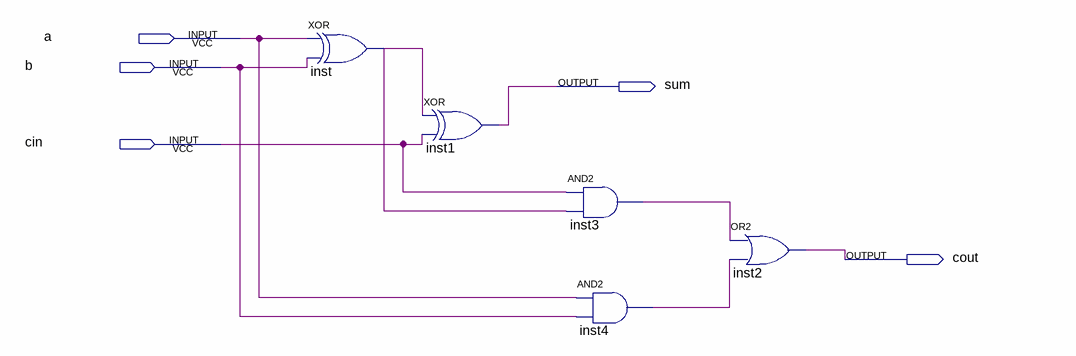
[diagram p0: schematic sheet]
// Quartus schematic fulladder.bdf as structural Verilog: 5 symbols, 5 pins
module fulladder (
  input  a,
  input  b,
  input  cin,
  output sum,
  output cout
);

  wire inst3_out, inst4_out, inst_out;

  xor inst (inst_out, a, b);
  xor inst1 (sum, inst_out, cin);
  and inst3 (inst3_out, cin, inst_out);
  and inst4 (inst4_out, a, b);
  or inst2 (cout, inst3_out, inst4_out);
endmodule
